# Altium schematic sheet Power.SchDoc
size A; DocumentNumber: 2; SheetNumber: 2; SheetTotal: 4
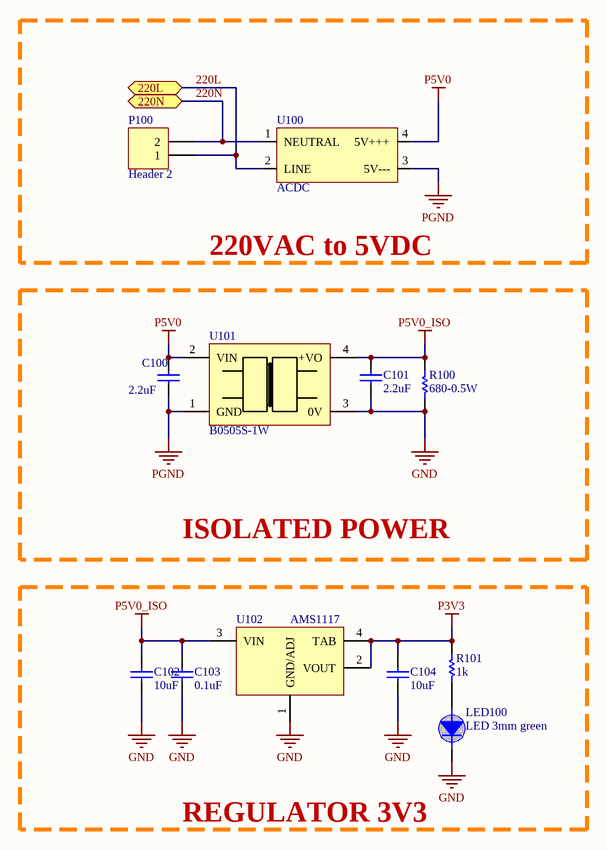
[diagram p0: Power.SchDoc]

## Parts
C100  2.2uF  [0805 cap]
C101  2.2uF  [0805 cap]
C102  10uF  [0805 cap]
C103  0.1uF  [0805 cap]
C104  10uF  [0805 cap]
LED100  LED 3mm green  [LED 3mm green]
P100  Header 2  [HED2T]
R100  680-0.5W  [0805 Resistor]
R101  1k  [0805 Resistor]
U100  ACDC  [ACDC]
U101  B0505S-1W  [B0505S-1W]
U102  AMS1117  [SOT223-3]

## Blocks framed on the sheet
220VAC to 5VDC: P100 U100
ISOLATED POWER: C100 C101 R100 U101
REGULATOR 3V3: C102-C104 LED100 R101 U102

## Ports
220L, 220N

## Nets
GND: C101.1 C102.1 C103.1 C104.1 LED100.2(Katot) R100.1 U101.3(0V) U102.1(GND/ADJ)
P3V3: C104.2 R101.2 U102.2(VOUT) U102.4(TAB)
P5V0: C100.2 U100.4(5V+++) U101.2(VIN)
P5V0_ISO: C101.2 C102.2 C103.2 R100.2 U101.4(+VO) U102.3(VIN)
PGND: C100.1 U100.3(5V---) U101.1(GND)
220L: P100.1 U100.2(LINE) ; port 220L
220N: P100.2 U100.1(NEUTRAL) ; port 220N
NetLED100_1: LED100.1(anot) R101.1

## Library data of the parts
C100-C104 = cap SMD
P100 = Header 2: Header, 2-Pin; LatestRevisionDate: 17-Jul-2002; LatestRevisionNote: Re-released for DXP Platform.; Publisher: Altium Limited
R100 R101 = Resistor